# Altium schematic sheet Input_Current_Limiting.SchDoc
size B
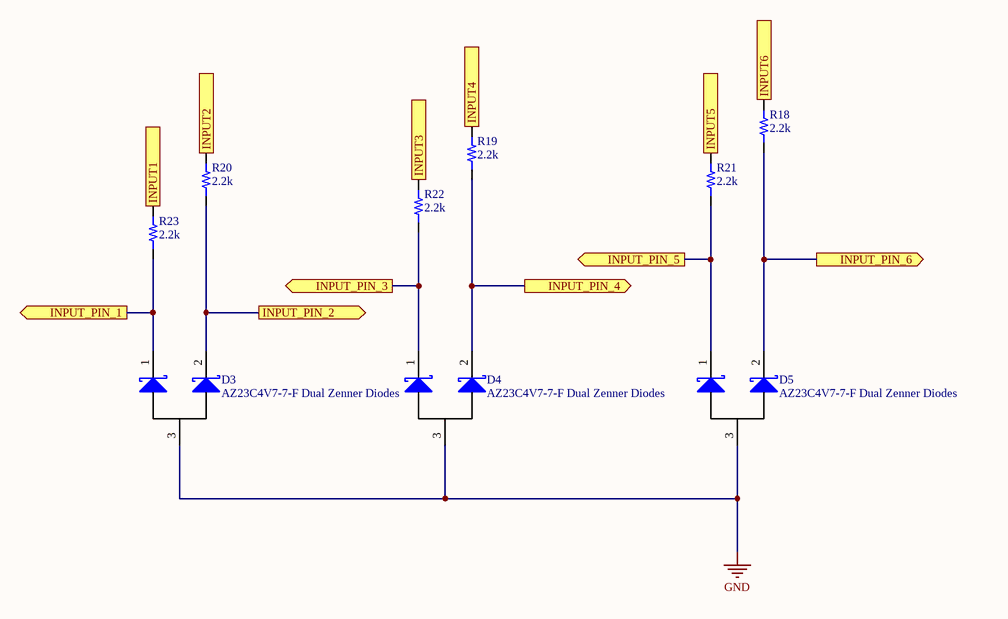
[diagram p0: Input_Current_Limiting.SchDoc]

## Parts
D3  AZ23C4V7-7-F Dual Zenner Diodes  [SOT23-3]
D4  AZ23C4V7-7-F Dual Zenner Diodes  [SOT23-3]
D5  AZ23C4V7-7-F Dual Zenner Diodes  [SOT23-3]
R18  value 2.2k  [RES 0603/1608]  (hidden comment: Resistor 2.2k 0603 1/10W 1%)
R19  value 2.2k  [RES 0603/1608]  (hidden comment: Resistor 2.2k 0603 1/10W 1%)
R20  value 2.2k  [RES 0603/1608]  (hidden comment: Resistor 2.2k 0603 1/10W 1%)
R21  value 2.2k  [RES 0603/1608]  (hidden comment: Resistor 2.2k 0603 1/10W 1%)
R22  value 2.2k  [RES 0603/1608]  (hidden comment: Resistor 2.2k 0603 1/10W 1%)
R23  value 2.2k  [RES 0603/1608]  (hidden comment: Resistor 2.2k 0603 1/10W 1%)

## Ports
INPUT1 (in), INPUT2 (in), INPUT3 (in), INPUT4 (in), INPUT5 (in), INPUT6 (in), INPUT_PIN_1 (out), INPUT_PIN_2 (out), INPUT_PIN_3 (out), INPUT_PIN_4 (out), INPUT_PIN_5 (out), INPUT_PIN_6 (out)

## Nets
GND: D3.3 D4.3 D5.3
INPUT1: R23.2 ; port INPUT1
INPUT2: R20.2 ; port INPUT2
INPUT3: R22.2 ; port INPUT3
INPUT4: R19.2 ; port INPUT4
INPUT5: R21.2 ; port INPUT5
INPUT6: R18.2 ; port INPUT6
INPUT_PIN_1: D3.1 R23.1 ; port INPUT_PIN_1
INPUT_PIN_2: D3.2 R20.1 ; port INPUT_PIN_2
INPUT_PIN_3: D4.1 R22.1 ; port INPUT_PIN_3
INPUT_PIN_4: D4.2 R19.1 ; port INPUT_PIN_4
INPUT_PIN_5: D5.1 R21.1 ; port INPUT_PIN_5
INPUT_PIN_6: D5.2 R18.1 ; port INPUT_PIN_6

## Library data of the parts
D3-D5 = 14: DIODE ZENER ARRAY 4.7V SOT23-3; Manufacturer_id: 1; idDiode: 14; Num_Circuits: 2; Power: 300mW; Created_By: Angel Delgado; Drawer_id: 1; Name: AZ23C4V7-7-F; Value: 4.7V; Type: Zener Array; Package: SOT23-3; MfrPartNo: AZ23C4V7-7-F; Link: https://www.digikey.com/product-detail/en/diodes-incorporated/AZ23C4V7-7-F/AZ23C4V7-FDICT-ND/815309; Supplier1: Digi-Key
R18-R23 = 297: Manufacturer_id: 1; idResistor: 297; Name: Res_2.2k_0603_1/10W_1%; Created_By: Nick Mah; Supplier 1: Digi-Key; Drawer_id: 1; Tolerance: 1%; Power: 1/10W; Package: 0603; ComponentLink1Description: Datasheet; Created_Date: 2018-10-20